# Altium project PCB_Business_Card.PrjPcb
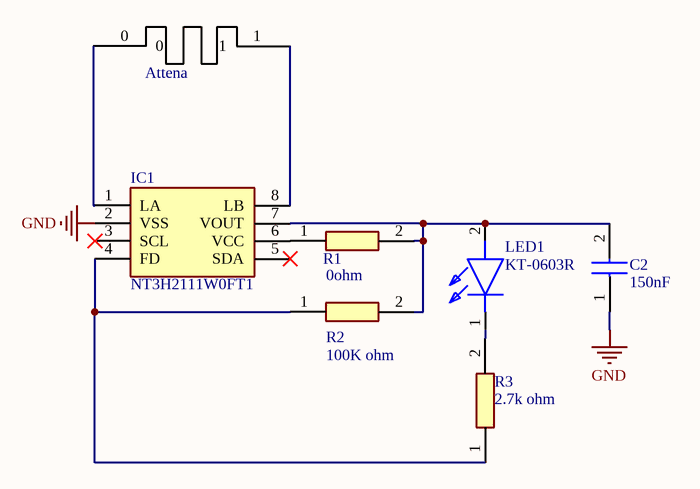
[diagram p0: PCB_Business_Card.SchDoc]
1 sheet, 7 parts. Net scope: global (net labels, ports and power ports of the same name join across sheets).
Board file: PCB_Business_Card.PcbDoc

## Sheet PCB_Business_Card.SchDoc
size A; SheetNumber: 1; SheetTotal: 1

### Parts
*  Attena  [PCBComponent_1 - duplicate]
C2  150nF  [CAPC1608X90N]
IC1  NT3H2111W0FT1  [SOIC127P600X175-8N]
LED1  KT-0603R  [LEDC1608X70N]
R1  0ohm  [RESC1608X55N]
R2  100K ohm  [RESC1608X55N]
R3  2.7k ohm  [RESC1608X55N]

### Nets
GND: C2.1 IC1.2(VSS)
Net*_0: *.0 IC1.1(LA)
Net*_1: *.1 IC1.8(LB)
NetC2_2: C2.2 IC1.7(VOUT) LED1.2(A) R1.2 R2.2
NetIC1_4: IC1.4(FD) R2.1 R3.1
NetIC1_6: IC1.6(VCC) R1.1
NetLED1_1: LED1.1(K) R3.2

Not connected (* = marked no-connect by the designer): IC1 3(SCL)* 5(SDA)*

### Library data of the parts
C2 = CC0603KRX7R7BB154: Capacitor; Manufacturer_Name: Yageo Group; Datasheet Link: https://www.yageo.com/upload/media/product/productsearch/datasheet/mlcc/UPY-NP0X7R_MV_100-to-630V_24.pdf; Height: 0.9mm; Manufacturer_Part_Number: CC0603KRX7R7BB154; Mouser Part Number: 603-CC603KRX7R7BB154; Mouser Price/Stock: https://www.mouser.com/Search/Refine.aspx?Keyword=603-CC603KRX7R7BB154; Arrow Part Number: CC0603KRX7R7BB154; Arrow Price/Stock: https://www.arrow.com/en/products/cc0603krx7r7bb154/yageo
IC1 = NT3H2111W0FT1: Integrated Circuit; Manufacturer_Name: NXP; Datasheet Link: https://www.nxp.com/docs/en/data-sheet/NT3H2111_2211.pdf; Height: 1.75mm; Manufacturer_Part_Number: NT3H2111W0FT1
LED1 = KT-0603R: LED; Manufacturer_Name: Hubei KENTO Elec; Datasheet Link: https://datasheet.lcsc.com/szlcsc/Hubei-KENTO-Elec-KT-0603R_C2286.pdf; Height: 0.7mm; Manufacturer_Part_Number: KT-0603R
R1 = 0603WAJ0000T5E: Resistor; Manufacturer_Name: ROYALOHM; Datasheet Link: https://datasheet.lcsc.com/lcsc/2110260030_UNI-ROYAL-Uniroyal-Elec-0603WAF4702T5E_C25819.pdf; Height: 0.55mm; Manufacturer_Part_Number: 0603WAJ0000T5E; Mouser Part Number: 303-0603WAJ0000T5E; Mouser Price/Stock: https://www.mouser.co.uk/ProductDetail/Royalohm/0603WAJ0000T5E?qs=e8oIoAS2J1T%252BUJj0iDaz%252BQ%3D%3D
R2 = RC0603FR-07100KL: Resistor; Manufacturer_Name: Yageo Group; Datasheet Link: https://www.yageo.com/upload/media/product/productsearch/datasheet/rchip/PYu-RC_Group_51_RoHS_L_12.pdf; Height: 0.55mm; Manufacturer_Part_Number: RC0603FR-07100KL; Mouser Part Number: 603-RC0603FR-07100KL; Mouser Price/Stock: https://www.mouser.co.uk/ProductDetail/YAGEO/RC0603FR-07100KL?qs=e1ok2LiJcmaihem8Va5%2Fsw%3D%3D; Arrow Part Number: RC0603FR-07100KL; Arrow Price/Stock: https://www.arrow.com/en/products/rc0603fr07100kl/yageo.html?utm_currency=USD&region=europe
R3 = 0603WAF2701T5E: Resistor; Manufacturer_Name: UNI-ROYAL(Uniroyal Elec); Datasheet Link: https://datasheet.lcsc.com/szlcsc/Uniroyal-Elec-0603WAF2701T5E_C13167.pdf; Height: 0.55mm; Manufacturer_Part_Number: 0603WAF2701T5E